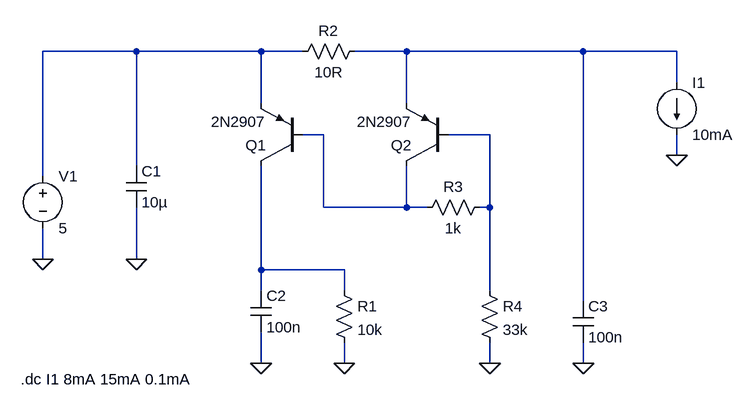
[diagram p0: schematic curr_limit.asc]
curr_limit.asc, the LTspice schematic file:
Version 4
SHEET 1 1296 680
WIRE 240 -96 96 -96
WIRE 432 -96 240 -96
WIRE 496 -96 432 -96
WIRE 656 -96 576 -96
WIRE 928 -96 656 -96
WIRE 1072 -96 928 -96
WIRE 1072 -48 1072 -96
WIRE 432 -16 432 -96
WIRE 656 -16 656 -96
WIRE 528 32 496 32
WIRE 784 32 720 32
WIRE 1072 64 1072 32
WIRE 240 80 240 -96
WIRE 96 96 96 -96
WIRE 528 144 528 32
WIRE 656 144 656 80
WIRE 656 144 528 144
WIRE 688 144 656 144
WIRE 784 144 784 32
WIRE 784 144 768 144
WIRE 96 224 96 176
WIRE 240 224 240 144
WIRE 432 240 432 80
WIRE 560 240 432 240
WIRE 432 272 432 240
WIRE 560 272 560 240
WIRE 784 272 784 144
WIRE 928 288 928 -96
WIRE 432 384 432 336
WIRE 560 384 560 352
WIRE 784 384 784 352
WIRE 928 384 928 352
FLAG 432 384 0
FLAG 560 384 0
FLAG 784 384 0
FLAG 96 224 0
FLAG 928 384 0
FLAG 240 224 0
FLAG 1072 64 0
SYMBOL voltage 96 80 R0
WINDOW 123 0 0 Left 2
WINDOW 39 0 0 Left 2
SYMATTR InstName V1
SYMATTR Value 5
SYMBOL pnp 496 80 R180
SYMATTR InstName Q1
SYMATTR Value 2N2907
SYMBOL pnp 720 80 R180
SYMATTR InstName Q2
SYMATTR Value 2N2907
SYMBOL res 592 -112 R90
WINDOW 0 0 56 VBottom 2
WINDOW 3 32 56 VTop 2
SYMATTR InstName R2
SYMATTR Value 10R
SYMBOL res 784 128 R90
WINDOW 0 0 56 VBottom 2
WINDOW 3 32 56 VTop 2
SYMATTR InstName R3
SYMATTR Value 1k
SYMBOL cap 224 80 R0
SYMATTR InstName C1
SYMATTR Value 10µ
SYMBOL cap 416 272 R0
SYMATTR InstName C2
SYMATTR Value 100n
SYMBOL res 544 256 R0
SYMATTR InstName R1
SYMATTR Value 10k
SYMBOL res 768 256 R0
SYMATTR InstName R4
SYMATTR Value 33k
SYMBOL cap 912 288 R0
SYMATTR InstName C3
SYMATTR Value 100n
SYMBOL load2 1072 -48 R0
WINDOW 123 0 0 Left 2
WINDOW 39 0 0 Left 2
SYMATTR InstName I1
SYMATTR Value 10mA
TEXT 62 408 Left 2 !.dc I1 8mA 15mA 0.1mA

The netlist it stands for:
* curr_limit.asc
V1 N001 0 5
Q1 N005 N003 N001 0 2N2907
Q2 N003 N004 N002 0 2N2907
R2 N002 N001 10R
R3 N004 N003 1k
C1 N001 0 10µ
C2 N005 0 100n
R1 N005 0 10k
R4 N004 0 33k
C3 N002 0 100n
I1 N002 0 10mA
.model NPN NPN
.model PNP PNP
.lib standard.bjt
.dc I1 8mA 15mA 0.1mA
.backanno
.end